# Altium project Echiquier.PrjPcb
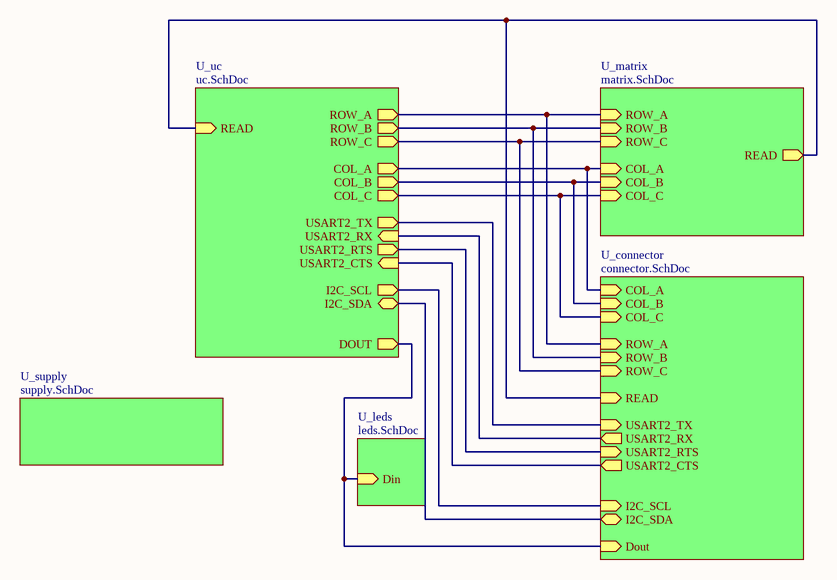
[diagram p0: chess_top.SchDoc]
5 sheets, 163 parts. Net scope: hierarchical (ports join the sheet entries above them; power ports are global).
Board file: ES_Class6C_2L.PcbDoc
Sheets:
  chess_top.SchDoc
    U_connector = connector.SchDoc
    U_matrix = matrix.SchDoc
    U_uc = uc.SchDoc
    U_supply = supply.SchDoc

## Sheet chess_top.SchDoc
size A4

### Sub-sheets
U_connector = connector.SchDoc: COL_C (in), COL_B (in), Dout (in), COL_A (in), ROW_B (in), USART2_RTS (in), USART2_RX (out), READ (in), USART2_TX (in), USART2_CTS (out), ROW_C (in), ROW_A (in), I2C_SDA (bidir), I2C_SCL (in)
U_leds = leds.SchDoc (file not in this document): Din (in)
U_matrix = matrix.SchDoc: COL_A (in), COL_B (in), ROW_B (in), COL_C (in), ROW_C (in), ROW_A (in), READ (out)
U_supply = supply.SchDoc: no entries
U_uc = uc.SchDoc: ROW_A (out), ROW_B (out), ROW_C (out), COL_A (out), COL_B (out), COL_C (out), READ (in), USART2_TX (out), USART2_RX (in), USART2_RTS (out), USART2_CTS (in), DOUT (out), I2C_SCL (out), I2C_SDA (bidir)

### Nets
COL0: sheet U_connector/COL_A, sheet U_matrix/COL_A, sheet U_uc/COL_A
COL1: sheet U_connector/COL_B, sheet U_matrix/COL_B, sheet U_uc/COL_B
COL2: sheet U_connector/COL_C, sheet U_matrix/COL_C, sheet U_uc/COL_C
DOUT: sheet U_connector/Dout, sheet U_leds/Din, sheet U_uc/DOUT
I2C1_SCL: sheet U_connector/I2C_SCL, sheet U_uc/I2C_SCL
I2C1_SDA: sheet U_connector/I2C_SDA, sheet U_uc/I2C_SDA
READ: sheet U_connector/READ, sheet U_matrix/READ, sheet U_uc/READ
ROW0: sheet U_connector/ROW_A, sheet U_matrix/ROW_A, sheet U_uc/ROW_A
ROW1: sheet U_connector/ROW_B, sheet U_matrix/ROW_B, sheet U_uc/ROW_B
ROW2: sheet U_connector/ROW_C, sheet U_matrix/ROW_C, sheet U_uc/ROW_C
U2CTS: sheet U_connector/USART2_CTS, sheet U_uc/USART2_CTS
U2RTS: sheet U_connector/USART2_RTS, sheet U_uc/USART2_RTS
U2RX: sheet U_connector/USART2_RX, sheet U_uc/USART2_RX
U2TX: sheet U_connector/USART2_TX, sheet U_uc/USART2_TX

## Sheet connector.SchDoc
size A4
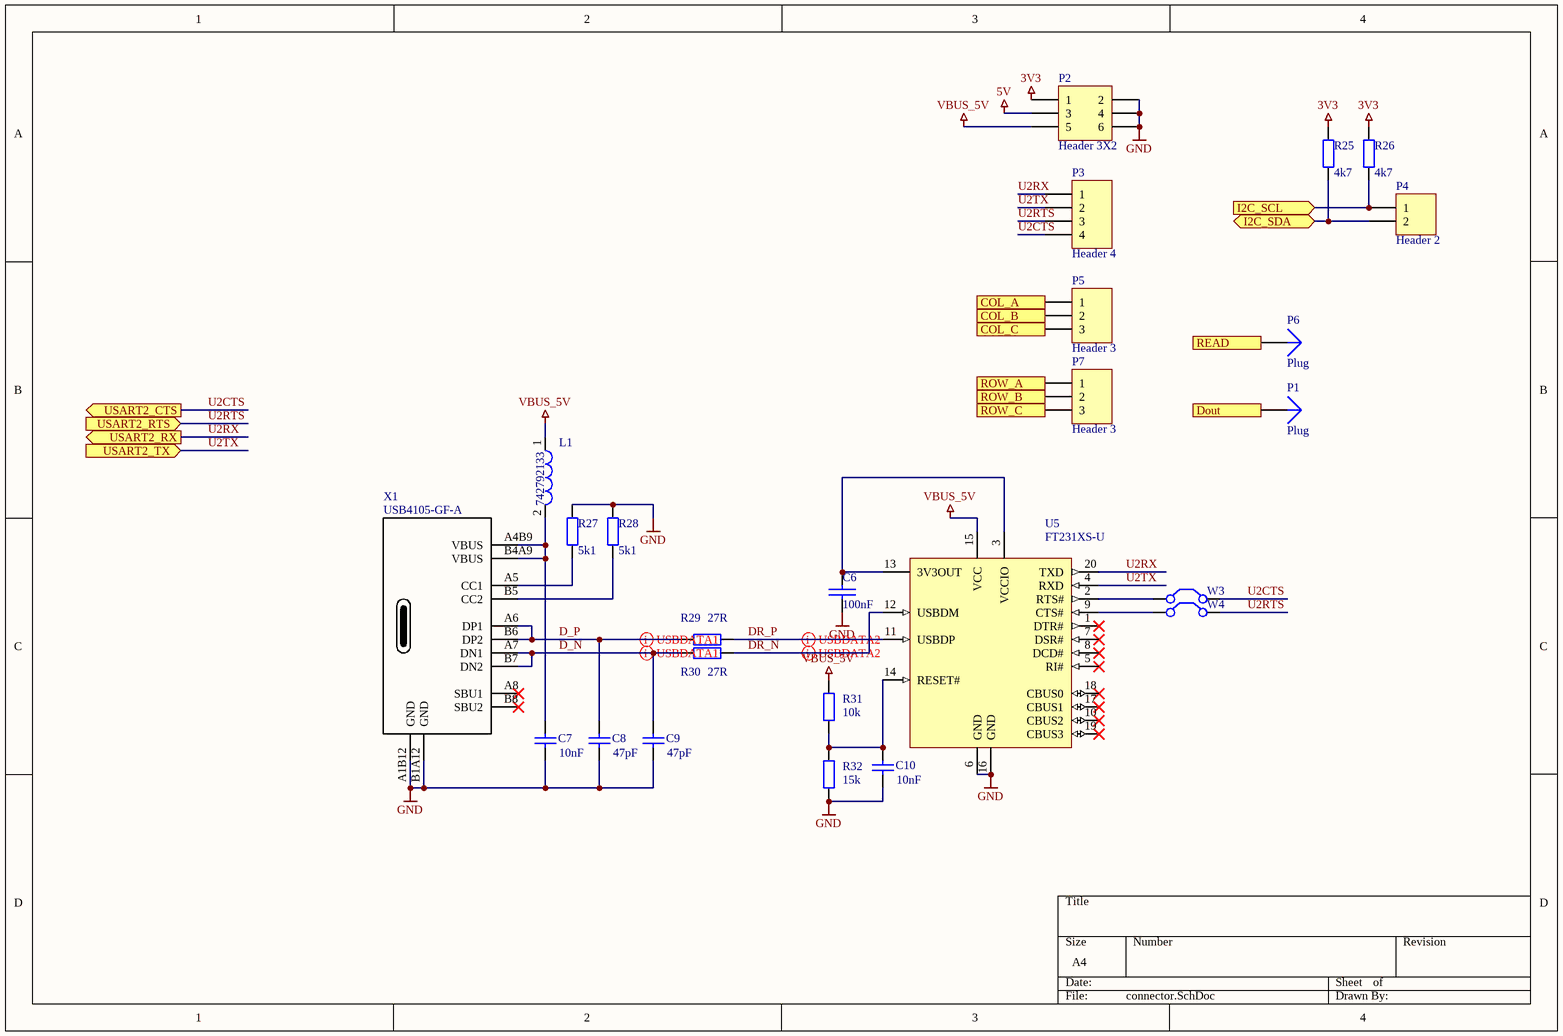
[diagram p1: connector.SchDoc]

### Parts
C6  100nF  [Cap_0805]
C7  10nF  [6-0805_L]
C8  47pF  [6-0805_L]
C9  47pF  [6-0805_L]
C10  10nF  [Cap_0805]
L1  742792133  [SMD-1206]
P1  Plug  [PIN1]
P2  Header 3X2  [HDR2X3]
P3  Header 4  [HDR1X4]
P4  Header 2  [HDR1X2]
P5  Header 3  [HDR1X3]
P6  Plug  [PIN1]
P7  Header 3  [HDR1X3]
R25  value 4k7  [RES_0805]  (hidden comment: 5k1)
R26  value 4k7  [RES_0805]  (hidden comment: 5k1)
R27  5k1  [RES_0805]
R28  5k1  [RES_0805]
R29  27R  [RES_0805]
R30  27R  [RES_0805]
R31  10k  [RES_0805]
R32  15k  [RES_0805]
U5  FT231XS-U  [SSOP-20_M]
W3  Jumper  [JUMPER]  (value not drawn)
W4  Jumper  [JUMPER]  (value not drawn)
X1  USB4105-GF-A  [GCT_USB4105-GF-A]

### Ports
COL_A (in), COL_B (in), COL_C (in), Dout (in), I2C_SCL (in), I2C_SDA (bidir), READ (in), ROW_A (in), ROW_B (in), ROW_C (in), USART2_CTS (out), USART2_RTS (in), USART2_RX (out), USART2_TX (in)

### Nets
3V3: P2.1 R25.2 R26.2
5V: P2.3
GND: C6.2 C7.1 C8.1 C9.1 C10.1 P2.2 P2.4 P2.6 R27.2 R28.2 R32.1 U5.6(GND) U5.16(GND) X1.A1B12(GND) X1.B1A12(GND)
VBUS_5V: L1.1 P2.5 R31.2 U5.15(VCC)
COL0: P5.1 ; port COL_A
COL1: P5.2 ; port COL_B
COL2: P5.3 ; port COL_C
D_N: C9.2 R30.1 X1.A7(DN1) X1.B7(DN2)
D_P: C8.2 R29.1 X1.A6(DP1) X1.B6(DP2)
DOUT: P1.1 ; port Dout
DR_N: R30.2 U5.12(USBDM)
DR_P: R29.2 U5.11(USBDP)
I2C1_SCL: P4.1 R26.1 ; port I2C_SCL
I2C1_SDA: P4.2 R25.1 ; port I2C_SDA
READ: P6.1 ; port READ
ROW0: P7.1 ; port ROW_A
ROW1: P7.2 ; port ROW_B
ROW2: P7.3 ; port ROW_C
U2CTS: P3.4 W3.2(C2) ; port USART2_CTS
U2RTS: P3.3 W4.2(C2) ; port USART2_RTS
U2RX: P3.1 U5.20(TXD) ; port USART2_RX
U2TX: P3.2 U5.4(RXD) ; port USART2_TX
NetC6_1: C6.1 U5.3(VCCIO) U5.13(3V3OUT)
NetC7_2: C7.2 L1.2 X1.A4B9(VBUS) X1.B4A9(VBUS)
NetC10_2: C10.2 R31.1 R32.2 U5.14(RESET#)
NetR27_1: R27.1 X1.A5(CC1)
NetR28_1: R28.1 X1.B5(CC2)
NetU5_2: U5.2(RTS#) W3.1(C1)
NetU5_9: U5.9(CTS#) W4.1(C1)

Not connected (* = marked no-connect by the designer): U5 1(DTR#)* 5(RI#)* 7(DSR#)* 8(DCD#)* 10(CBUS2)* 17(CBUS1)* 18(CBUS0)* 19(CBUS3)*; X1 A8(SBU1)* B8(SBU2)*

### Layout directives
differential pair: D_N, D_P, DR_N, DR_P

### Library data of the parts
C6 = C: SDTSourceLibName: C:\WINDOWS\TEMP\DA.LIB; PCB Footprint: RC0805
C7-C10 = Cap: Capacitor; Published: 8-Jun-2000; LatestRevisionDate: 17-Jul-2002; LatestRevisionNote: Re-released for DXP Platform.; PackageReference: RAD-0.3; Publisher: Altium Limited; PackageDescription: Radial Cap, Thru-Hole; 2 Leads; 0.3 in Pin Spacing
  C7 C10: Value: 10nF
  C8 C9: Value: 47pF
L1 = CMP-0220-00010-1: SMD EMI Suppression Ferrite Bead WE-CBF, Z = 600 Ohm; Impedance: 600 Ohm; ComponentLink1Description: Manufacturer Link; DatasheetVersion: ver 2, Aug-2007; ComponentLink1URL: http://www.we-online.com; PackageDescription: Chip Inductor, 2-Leads, Body 3.2 x 1.6 mm; ComponentLink2URL: http://www.we-online.de/katalog/media/pdf/742792133.pdf; PackageVersion: 2007; PackageReference: SMD-1206; ComponentLink2Description: Datasheet
P2 = Header 3X2: Header, 3-Pin, Dual row; LatestRevisionDate: 17-Jul-2002; LatestRevisionNote: Re-released for DXP Platform.; Publisher: Altium Limited
P3 = Header 4: Header, 4-Pin; LatestRevisionDate: 17-Jul-2002; LatestRevisionNote: Re-released for DXP Platform.; Publisher: Altium Limited
P4 = Header 2: Header, 2-Pin; LatestRevisionDate: 17-Jul-2002; LatestRevisionNote: Re-released for DXP Platform.; Publisher: Altium Limited
P5 P7 = Header 3: Header, 3-Pin; LatestRevisionDate: 17-Jul-2002; LatestRevisionNote: Re-released for DXP Platform.; Publisher: Altium Limited
R25-R32 = Res2: Res 0805; Published: 8-Jun-2000; LatestRevisionDate: 17-Jul-2002; LatestRevisionNote: Re-released for DXP Platform.; PackageReference: AXIAL-0.4; Publisher: Altium Limited; PackageDescription: Axial Device, Thru-Hole; 2 Leads; 0.4 in Pin Spacing
  R27 R28: Value: 5k1
  R29 R30: Value: 27R
  R31: Value: 10k
  R32: Value: 15k
U5 = CMP-0248-00015-2: USB to Full-Handshake UART Interface Chip, UHCI/OHCI/EHCI Compatible, USB 2.0 Compatible, -40 to +85 degC, 20-Pin SSOP, Pb-Free, Tube; Manufacturer: FTDI; PackageDescription: 20-Pin Small Outline Package, 8.6 x 3.9 mm Body, 0.635 mm Pitch; ComponentLink2Description: Datasheet; DatasheetVersion: ver 1.2, Feb-2013; PackageReference: SSOP-20; ComponentLink3URL: www.ftdichip.com/Products/ICs/FT231X.html; ComponentLink2URL: http://www.ftdichip.com/Support/Documents/DataSheets/ICs/DS_FT231X.pdf; PartNumber: FT231XS-U; ComponentLink3Description: FT231X Product Page; ComponentLink1URL: http://www.ftdichip.com/; Code_JEDEC: MO-137-AD; ComponentLink1Description: Manufacturer URL; RevisionNote: DatasheetVersion updated to 1.2 Feb-2013; PackageVersion: Feb-13
W3 W4 = Jumper: Jumper Wire; Published: 24-Mar-1999; LatestRevisionDate: 17-Jul-2002; LatestRevisionNote: Re-released for DXP Platform.; PackageReference: RAD-0.2; Publisher: Altium Limited; PackageDescription: Radial Cap, Thru-Hole; 2 Leads; 0.2 in Pin Spacing
X1 = USB-C Type 2.0: USB4105-GF-A USB connector; ComponentLink1Description: LCSC  C319148; ComponentLink1URL: https://lcsc.com/product-detail/USB-Connectors_XKB-Connectivity-U262-161N-4BVC11_C319148.html; Supplier 1: LCSC; Supplier Part Number 1: C319148
P1 P6 = Plug: LatestRevisionDate: 17-Jul-2002; LatestRevisionNote: Re-released for DXP Platform.; Publisher: Altium Limited

## Sheet matrix.SchDoc
size A3
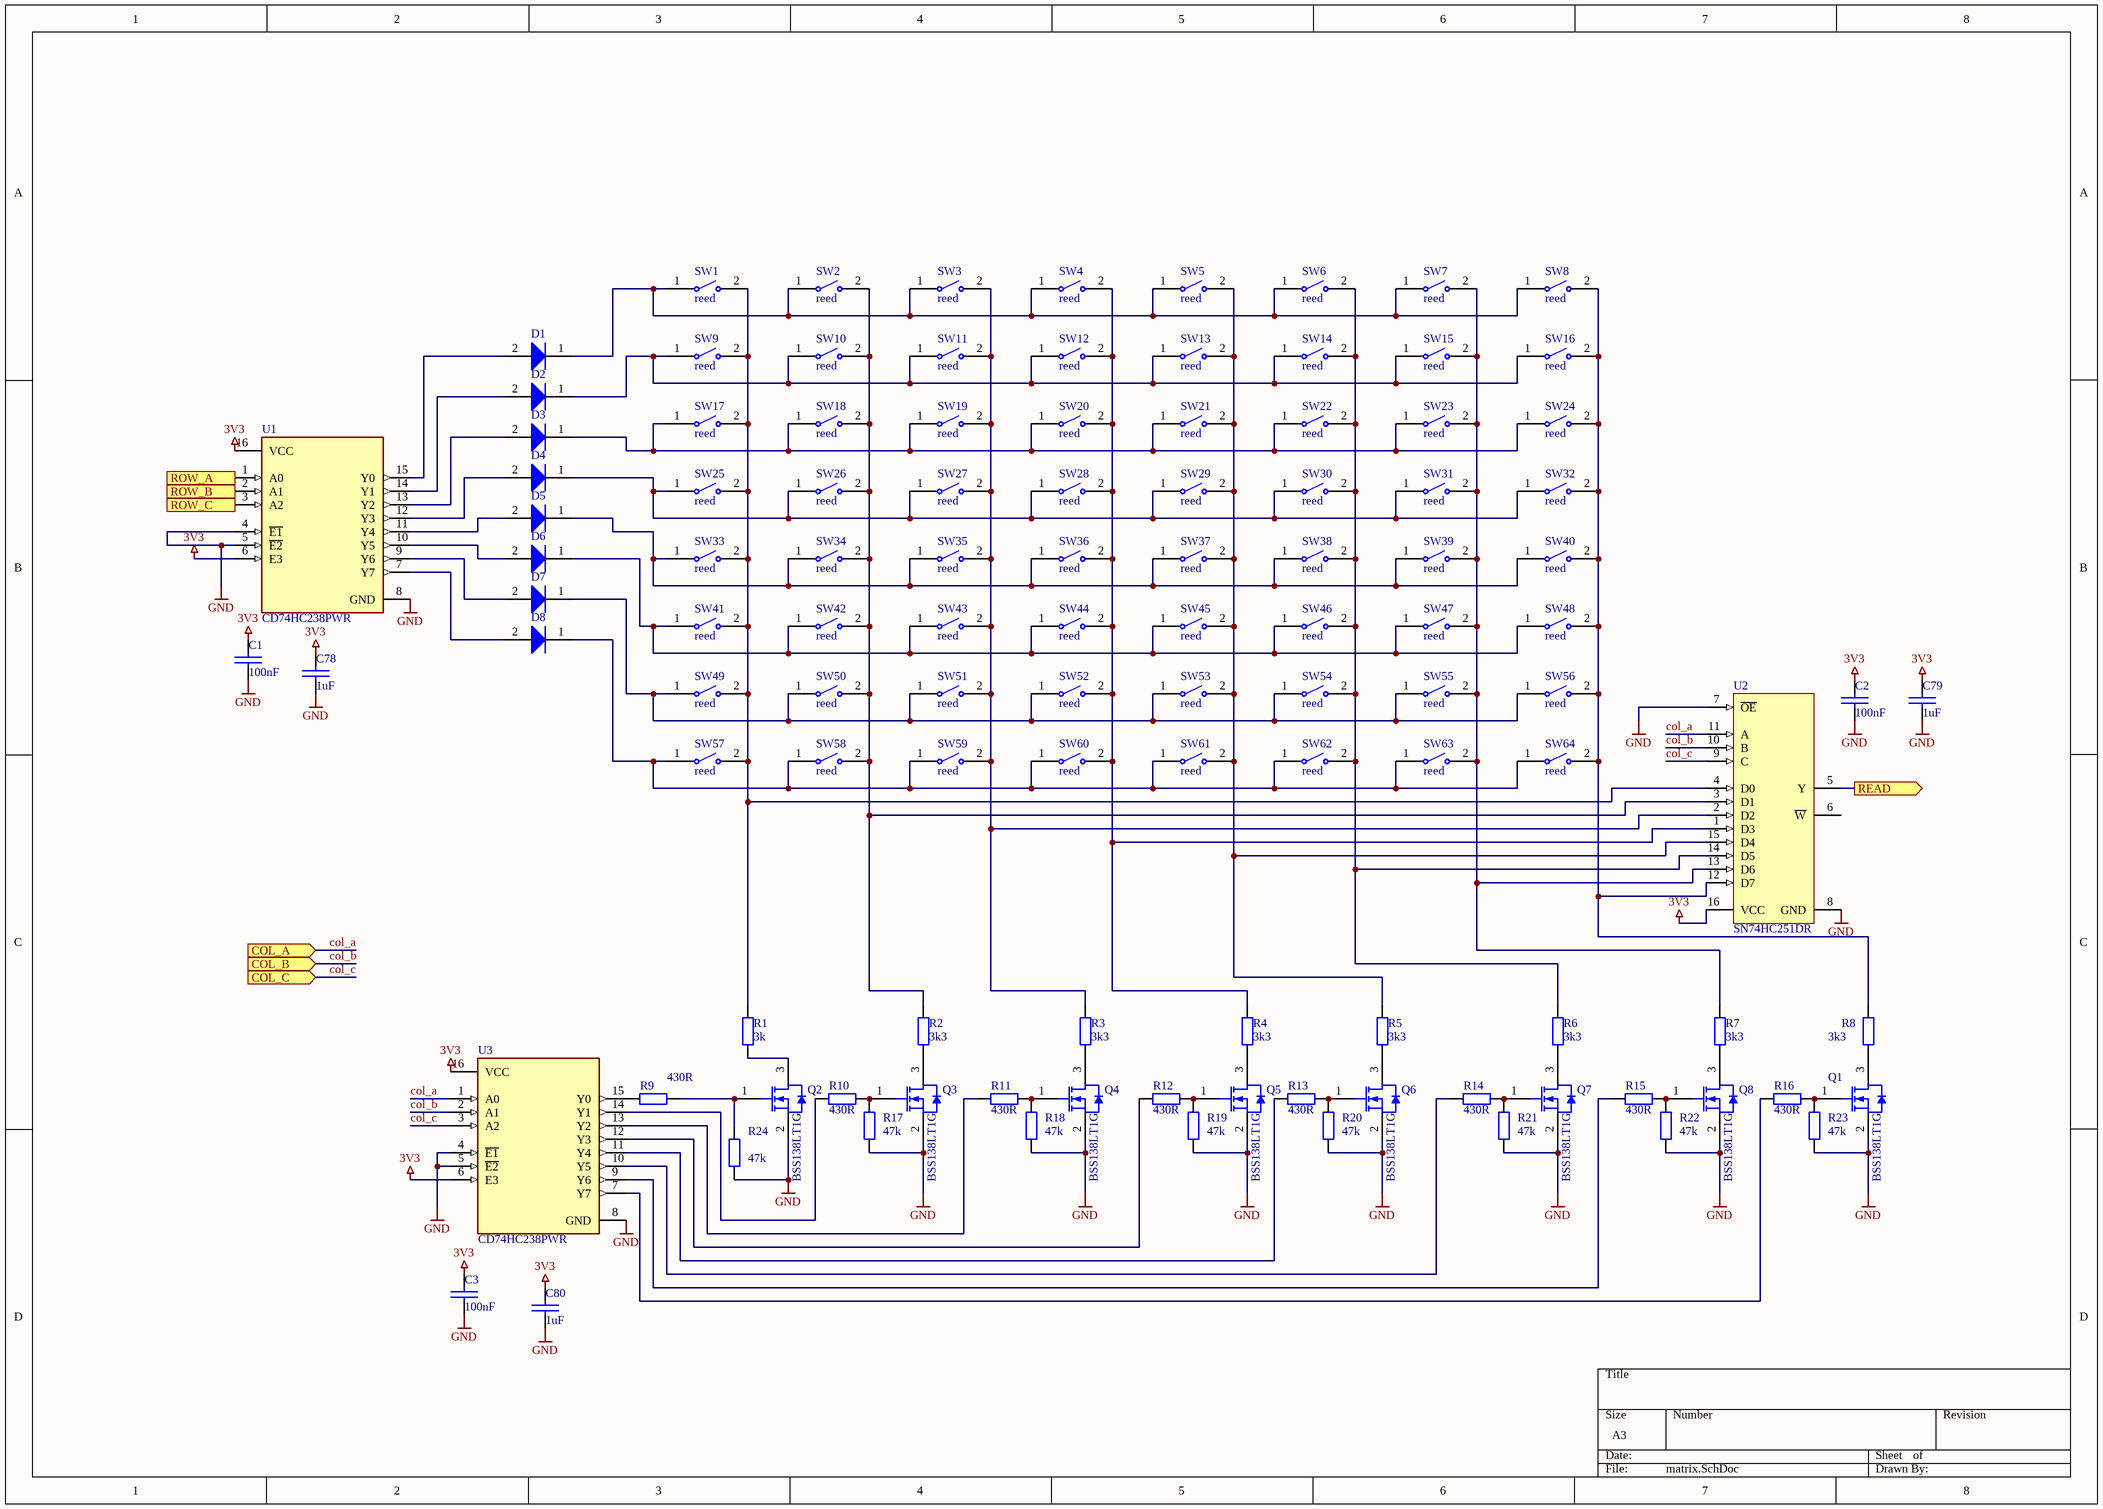
[diagram p2: matrix.SchDoc]

### Parts
C1  100nF  [Cap_0805]
C2  100nF  [Cap_0805]
C3  100nF  [Cap_0805]
C78  1uF  [Cap_0805]
C79  1uF  [Cap_0805]
C80  1uF  [Cap_0805]
D1  BAT54HT1G  [ONSC-SOD-323-2-477-02_V]  (value not drawn)
D2  BAT54HT1G  [ONSC-SOD-323-2-477-02_V]  (value not drawn)
D3  BAT54HT1G  [ONSC-SOD-323-2-477-02_V]  (value not drawn)
D4  BAT54HT1G  [ONSC-SOD-323-2-477-02_V]  (value not drawn)
D5  BAT54HT1G  [ONSC-SOD-323-2-477-02_V]  (value not drawn)
D6  BAT54HT1G  [ONSC-SOD-323-2-477-02_V]  (value not drawn)
D7  BAT54HT1G  [ONSC-SOD-323-2-477-02_V]  (value not drawn)
D8  BAT54HT1G  [ONSC-SOD-323-2-477-02_V]  (value not drawn)
Q1  BSS138LT1G  [ONSC-SOT-23-3-318-08_V]
Q2  BSS138LT1G  [ONSC-SOT-23-3-318-08_V]
Q3  BSS138LT1G  [ONSC-SOT-23-3-318-08_V]
Q4  BSS138LT1G  [ONSC-SOT-23-3-318-08_V]
Q5  BSS138LT1G  [ONSC-SOT-23-3-318-08_V]
Q6  BSS138LT1G  [ONSC-SOT-23-3-318-08_V]
Q7  BSS138LT1G  [ONSC-SOT-23-3-318-08_V]
Q8  BSS138LT1G  [ONSC-SOT-23-3-318-08_V]
R1  value 3k  [RES_0805]  (hidden comment: 430R)
R2  value 3k3  [RES_0805]  (hidden comment: 430R)
R3  value 3k3  [RES_0805]  (hidden comment: 430R)
R4  value 3k3  [RES_0805]  (hidden comment: 430R)
R5  value 3k3  [RES_0805]  (hidden comment: 430R)
R6  value 3k3  [RES_0805]  (hidden comment: 430R)
R7  value 3k3  [RES_0805]  (hidden comment: 430R)
R8  value 3k3  [RES_0805]  (hidden comment: 430R)
R9  430R  [RES_0805]
R10  430R  [RES_0805]
R11  430R  [RES_0805]
R12  430R  [RES_0805]
R13  430R  [RES_0805]
R14  430R  [RES_0805]
R15  430R  [RES_0805]
R16  430R  [RES_0805]
R17  value 47k  [RES_0805]  (hidden comment: 10k)
R18  value 47k  [RES_0805]  (hidden comment: 10k)
R19  value 47k  [RES_0805]  (hidden comment: 10k)
R20  value 47k  [RES_0805]  (hidden comment: 10k)
R21  value 47k  [RES_0805]  (hidden comment: 10k)
R22  value 47k  [RES_0805]  (hidden comment: 10k)
R23  value 47k  [RES_0805]  (hidden comment: 10k)
R24  value 47k  [RES_0805]  (hidden comment: 10k)
SW1  reed  [reed]
SW2  reed  [reed]
SW3  reed  [reed]
SW4  reed  [reed]
SW5  reed  [reed]
SW6  reed  [reed]
SW7  reed  [reed]
SW8  reed  [reed]
SW9  reed  [reed]
SW10  reed  [reed]
SW11  reed  [reed]
SW12  reed  [reed]
SW13  reed  [reed]
SW14  reed  [reed]
SW15  reed  [reed]
SW16  reed  [reed]
SW17  reed  [reed]
SW18  reed  [reed]
SW19  reed  [reed]
SW20  reed  [reed]
SW21  reed  [reed]
SW22  reed  [reed]
SW23  reed  [reed]
SW24  reed  [reed]
SW25  reed  [reed]
SW26  reed  [reed]
SW27  reed  [reed]
SW28  reed  [reed]
SW29  reed  [reed]
SW30  reed  [reed]
SW31  reed  [reed]
SW32  reed  [reed]
SW33  reed  [reed]
SW34  reed  [reed]
SW35  reed  [reed]
SW36  reed  [reed]
SW37  reed  [reed]
SW38  reed  [reed]
SW39  reed  [reed]
SW40  reed  [reed]
SW41  reed  [reed]
SW42  reed  [reed]
SW43  reed  [reed]
SW44  reed  [reed]
SW45  reed  [reed]
SW46  reed  [reed]
SW47  reed  [reed]
SW48  reed  [reed]
SW49  reed  [reed]
SW50  reed  [reed]
SW51  reed  [reed]
SW52  reed  [reed]
SW53  reed  [reed]
SW54  reed  [reed]
SW55  reed  [reed]
SW56  reed  [reed]
SW57  reed  [reed]
SW58  reed  [reed]
SW59  reed  [reed]
SW60  reed  [reed]
SW61  reed  [reed]
SW62  reed  [reed]
SW63  reed  [reed]
SW64  reed  [reed]
U1  CD74HC238PWR  [FP-PW0016A-IPC_A]
U2  SN74HC251DR  [D0016A_L]
U3  CD74HC238PWR  [FP-PW0016A-IPC_A]

### Ports
COL_A (in), COL_B (in), COL_C (in), READ (out), ROW_A (in), ROW_B (in), ROW_C (in)

### Nets
3V3: C1.1 C2.1 C3.1 C78.1 C79.1 C80.1 U1.6(E3) U1.16(VCC) U2.16(VCC) U3.6(E3) U3.16(VCC)
GND: C1.2 C2.2 C3.2 C78.2 C79.2 C80.2 Q1.2(S) Q2.2(S) Q3.2(S) Q4.2(S) Q5.2(S) Q6.2(S) Q7.2(S) Q8.2(S) R17.1 R18.1 R19.1 R20.1 R21.1 R22.1 R23.1 R24.1 U1.4(~{E1}) U1.5(~{E2}) U1.8(GND) U2.7(~{OE}) U2.8(GND) U3.4(~{E1}) U3.5(~{E2}) U3.8(GND)
col_a: U2.11(A) U3.1(A0) ; port COL_A  [project net COL0]
col_b: U2.10(B) U3.2(A1) ; port COL_B  [project net COL1]
col_c: U2.9(C) U3.3(A2) ; port COL_C  [project net COL2]
READ: U2.5(Y) ; port READ
ROW0: U1.1(A0) ; port ROW_A
ROW1: U1.2(A1) ; port ROW_B
ROW2: U1.3(A2) ; port ROW_C
NetD1_1: D1.1(K) SW1.1 SW2.1 SW3.1 SW4.1 SW5.1 SW6.1 SW7.1 SW8.1
NetD1_2: D1.2(A) U1.15(Y0)
NetD2_1: D2.1(K) SW9.1 SW10.1 SW11.1 SW12.1 SW13.1 SW14.1 SW15.1 SW16.1
NetD2_2: D2.2(A) U1.14(Y1)
NetD3_1: D3.1(K) SW17.1 SW18.1 SW19.1 SW20.1 SW21.1 SW22.1 SW23.1 SW24.1
NetD3_2: D3.2(A) U1.13(Y2)
NetD4_1: D4.1(K) SW25.1 SW26.1 SW27.1 SW28.1 SW29.1 SW30.1 SW31.1 SW32.1
NetD4_2: D4.2(A) U1.12(Y3)
NetD5_1: D5.1(K) SW33.1 SW34.1 SW35.1 SW36.1 SW37.1 SW38.1 SW39.1 SW40.1
NetD5_2: D5.2(A) U1.11(Y4)
NetD6_1: D6.1(K) SW41.1 SW42.1 SW43.1 SW44.1 SW45.1 SW46.1 SW47.1 SW48.1
NetD6_2: D6.2(A) U1.10(Y5)
NetD7_1: D7.1(K) SW49.1 SW50.1 SW51.1 SW52.1 SW53.1 SW54.1 SW55.1 SW56.1
NetD7_2: D7.2(A) U1.9(Y6)
NetD8_1: D8.1(K) SW57.1 SW58.1 SW59.1 SW60.1 SW61.1 SW62.1 SW63.1 SW64.1
NetD8_2: D8.2(A) U1.7(Y7)
NetQ1_1: Q1.1(G) R16.1 R23.2
NetQ1_3: Q1.3(D) R8.2
NetQ2_1: Q2.1(G) R9.1 R24.2
NetQ2_3: Q2.3(D) R1.2
NetQ3_1: Q3.1(G) R10.1 R17.2
NetQ3_3: Q3.3(D) R2.2
NetQ4_1: Q4.1(G) R11.1 R18.2
NetQ4_3: Q4.3(D) R3.2
NetQ5_1: Q5.1(G) R12.1 R19.2
NetQ5_3: Q5.3(D) R4.2
NetQ6_1: Q6.1(G) R13.1 R20.2
NetQ6_3: Q6.3(D) R5.2
NetQ7_1: Q7.1(G) R14.1 R21.2
NetQ7_3: Q7.3(D) R6.2
NetQ8_1: Q8.1(G) R15.1 R22.2
NetQ8_3: Q8.3(D) R7.2
NetR1_1: R1.1 SW1.2 SW9.2 SW17.2 SW25.2 SW33.2 SW41.2 SW49.2 SW57.2 U2.4(D0)
NetR2_1: R2.1 SW2.2 SW10.2 SW18.2 SW26.2 SW34.2 SW42.2 SW50.2 SW58.2 U2.3(D1)
NetR3_1: R3.1 SW3.2 SW11.2 SW19.2 SW27.2 SW35.2 SW43.2 SW51.2 SW59.2 U2.2(D2)
NetR4_1: R4.1 SW4.2 SW12.2 SW20.2 SW28.2 SW36.2 SW44.2 SW52.2 SW60.2 U2.1(D3)
NetR5_1: R5.1 SW5.2 SW13.2 SW21.2 SW29.2 SW37.2 SW45.2 SW53.2 SW61.2 U2.15(D4)
NetR6_1: R6.1 SW6.2 SW14.2 SW22.2 SW30.2 SW38.2 SW46.2 SW54.2 SW62.2 U2.14(D5)
NetR7_1: R7.1 SW7.2 SW15.2 SW23.2 SW31.2 SW39.2 SW47.2 SW55.2 SW63.2 U2.13(D6)
NetR8_1: R8.1 SW8.2 SW16.2 SW24.2 SW32.2 SW40.2 SW48.2 SW56.2 SW64.2 U2.12(D7)
NetR9_2: R9.2 U3.15(Y0)
NetR10_2: R10.2 U3.14(Y1)
NetR11_2: R11.2 U3.13(Y2)
NetR12_2: R12.2 U3.12(Y3)
NetR13_2: R13.2 U3.11(Y4)
NetR14_2: R14.2 U3.10(Y5)
NetR15_2: R15.2 U3.9(Y6)
NetR16_2: R16.2 U3.7(Y7)

Not connected (* = marked no-connect by the designer): U2 6(~{W})

### Library data of the parts
C1-C3 C78-C80 = C: as C6 on sheet connector
D1-D8 = CMP-1055-00462-1: Schottky Barrier Diode, 2-Pin SOD-323, Pb-Free, Tape and Reel; Manufacturer: On Semiconductor; Configuration: Single; trr Max (ns): 5; IFSM Max (A): 0.6; ComponentLink3URL: http://www.onsemi.com/pub_link/Collateral/477-02.PDF.1; PackageDescription: 2-Pin SOD, Body 1.7 x 1.25 mm; ComponentLink2URL: http://www.onsemi.cn/pub_link/Collateral/BAT54HT1-D.PDF; ComponentLink3Description: Package Specification; ComponentLink2Description: Datasheet; DatasheetVersion: Rev. 6; PackageReference: SOD-323-2-477-02; RoHS: TRUE; ComponentLink1URL: http://www.onsemi.com/; Packing: Tape and Reel; PartNumber: BAT54HT1G; Mounting Technology: Surface Mount; ComponentLink1Description: Manufacturer URL; PackageVersion: Rev. H, 03/2007
Q1-Q8 = CMP-1058-00767-1: Power MOSFET, 200 mA, 50 V, N-Channel, 3-Pin SOT-23, Pb-Free, Tape and Reel; Manufacturer: On Semiconductor; PD Max (W): 0.225; Coss Typ (pF): 12; V(BR)DSS Min (V): 50; VGS Max (V): 20; Channel Polarity: N Channel; Configuration: Single; VGS(th) Max (V): 1.5; Ciss Typ (pF): 40; Crss Typ (pF): 3.5; ID Max (A): 0.2; ComponentLink3Description: Package Specification; PackageDescription: 3-Pin Small Outline Transistor, Body 2.92 x 1.3 mm, Pitch 0.95 mm; PackageReference: SOT-23-3-318-08; RoHS: Pb-Free; Mounting Technology: Surface Mount; ComponentLink1Description: Manufacturer URL; ComponentLink2URL: http://www.onsemi.com/pub_link/Collateral/BSS138LT1-D.PDF; ComponentLink2Description: Datasheet; Packing: Tape and Reel; PackageVersion: Rev. AP, 11/2009; PartNumber: BSS138LT1G; Package Type: SOT-23-3; ComponentLink1URL: http://www.onsemi.com/; DatasheetVersion: Rev. 8; ComponentLink3URL: http://www.onsemi.cn/pub_link/Collateral/318-08.PDF
R1-R24 = Res2: Res 0805; Published: 8-Jun-2000; LatestRevisionDate: 17-Jul-2002; LatestRevisionNote: Re-released for DXP Platform.; PackageReference: AXIAL-0.4; Publisher: Altium Limited; PackageDescription: Axial Device, Thru-Hole; 2 Leads; 0.4 in Pin Spacing
  R9-R16: Value: 430R
U1 U3 = CMP-1633-00899-3: IC DECODER/DEMUX 1X3:8 16TSSOP; Max Supply Voltage: 6V; Low Level Output Current: 5.2mA; Number of Channels: 1; Quiescent Current: 8uA; Min Supply Voltage: 2V; Supply Type: Single; Polarity: Non-Inverting; Number of Input Lines: 3; Output Current: 25mA; Turn-On Delay Time: 265ns; Number of Output Lines: 8; Logic Function: Demultiplexer; High Level Output Current: -5.2mA; Rise Time: 400ns; Bandwidth: 28MHz; Max Operating Temperature: 125°C; Independent Circuits: 1; Weight: 0.002183oz; Radiation Hardening: No; Output Voltage: 6V; Min Operating Temperature: -55°C; Package Quantity: 2000; REACH SVHC: No SVHC; Packaging: Tape and Reel; Lead Free: Lead Free; Contact Plating: Gold; Mount: Surface Mount; Height: 1.15mm; Case/Package: TSSOP; Number of Bits: 8; Number of Inputs: 3; Termination: SMD/SMT; Number of Outputs: 8; Number of Pins: 16; Number of Circuits: 1; Max Supply Current: 8uA; Series: 74HC; Number of Elements: 1; RoHS Compliant: Yes; Length: 5mm; Propagation Delay: 265ns; Width: 4.4mm; Technology: CMOS; Max Frequency: 28MHz
U2 = CMP-1633-00067-2: Data Selectors/Multiplexers With 3-State Outputs, D0016A, LARGE T&R; Manufacturer: Texas Instruments; Input Type: LVTTL/CMOS; Rating: Catalog; F @ Nom Voltage(Max)(Mhz): 28; Voltage(Nom)(V): 3.3,5; tpd @ Nom Voltage(Max)(ns): 51; Schmitt Trigger: No; VCC(Max)(V): 6; VCC(Min)(V): 2; Channels(#): 1; Configuration: 8：1; Bits(#): 8; Function: Encoder/Multiplexer; ICC @ Nom Voltage(Max)(mA): 0.08; Output Type: CMOS; Technology Family: HC; Output Drive (IOL/IOH)(Max)(mA): 7.8/-7.8; PackageReference: D0016A; Type: 3-State Output; Operating Temperature Range(C): -40 to 85; Code_JEDEC: MS-012 variation AC; DatasheetVersion: SCLS132E; Generic Part Number: SN74HC251

## Sheet uc.SchDoc
size A4
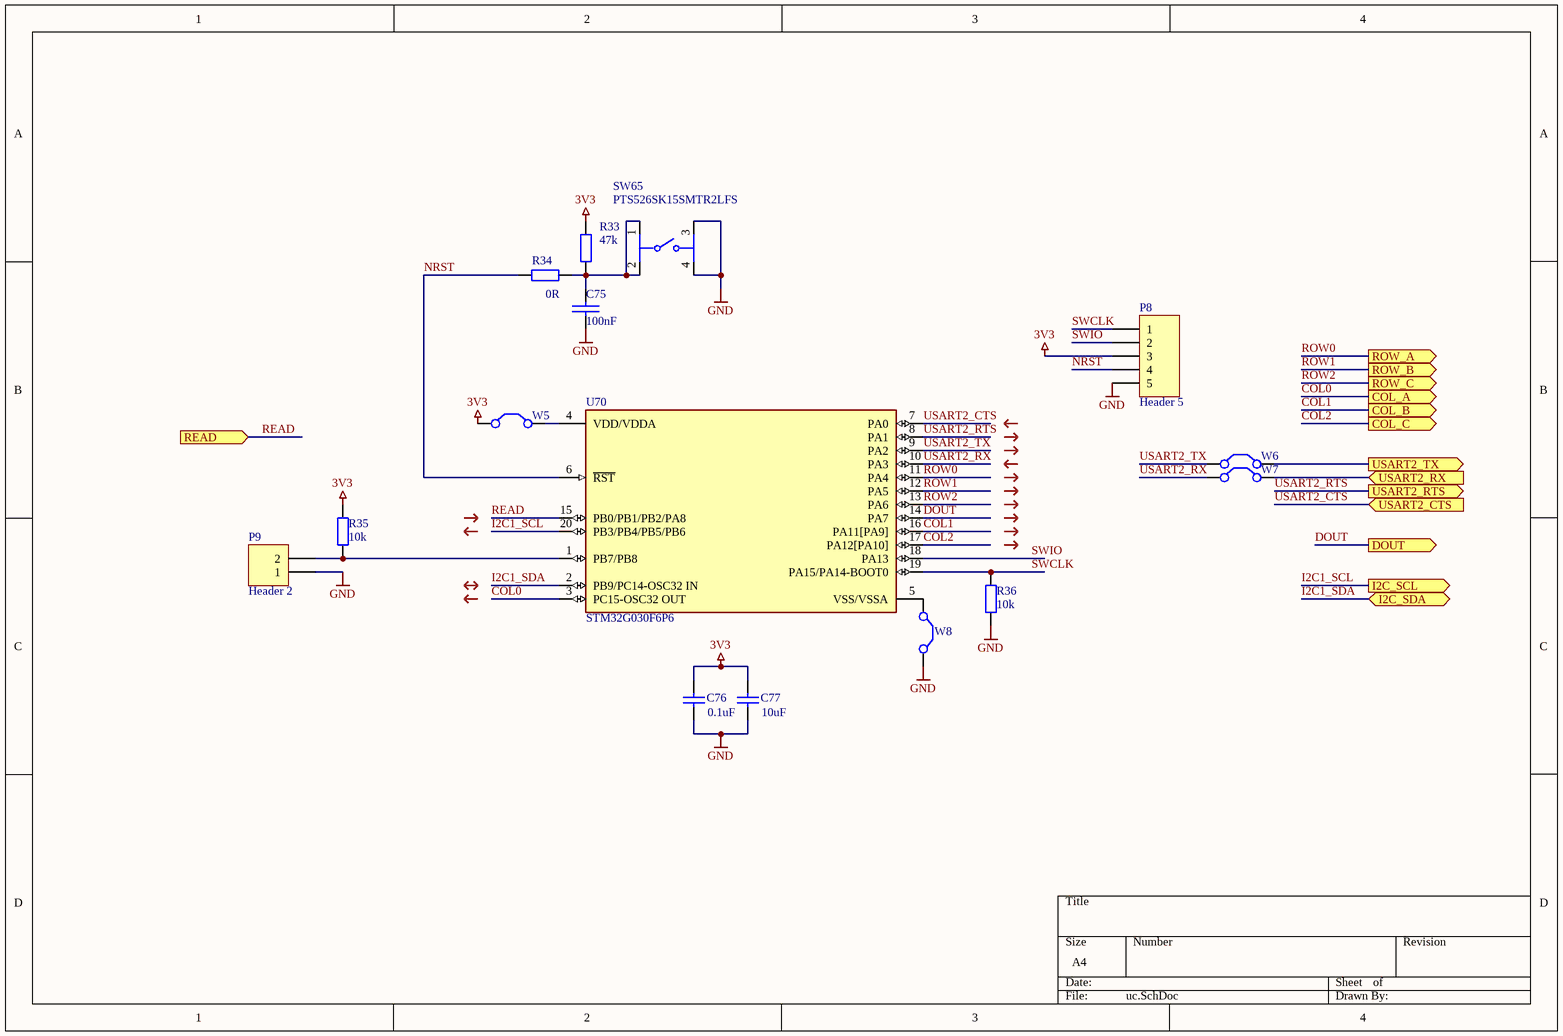
[diagram p3: uc.SchDoc]

### Parts
C75  100nF  [Cap_0805]
C76  0.1uF  [Cap_0805]
C77  10uF  [Cap_0805]
P8  Header 5  [HDR1X5]
P9  Header 2  [HDR1X2]
R33  47k  [RES_0805]
R34  0R  [RES_0805]
R35  10k  [RES_0805]
R36  10k  [RES_0805]
SW65  PTS526SK15SMTR2LFS  [FP-PTS526SK15SMTR2LFS-MFG]
U70  STM32G030F6P6  [FP-TSSOP20-YA-MFG]
W5  Jumper  [JUMPER]  (value not drawn)
W6  Jumper  [JUMPER]  (value not drawn)
W7  Jumper  [JUMPER]  (value not drawn)
W8  Jumper  [JUMPER]  (value not drawn)

### Ports
COL_A (out), COL_B (out), COL_C (out), DOUT (out), I2C_SCL (out), I2C_SDA (bidir), READ (in), ROW_A (out), ROW_B (out), ROW_C (out), USART2_CTS (in), USART2_RTS (out), USART2_RX (in), USART2_TX (out)

### Nets
3V3: C76.2 C77.2 P8.3 R33.1 R35.2 W5.1(C1)
GND: C75.2 C76.1 C77.1 P8.5 P9.1 R36.1 SW65.3 SW65.4 W8.2(C2)
COL0: U70.3(PC15-OSC32_OUT) ; port COL_A
COL1: U70.16(PA11[PA9]) ; port COL_B
COL2: U70.17(PA12[PA10]) ; port COL_C
DOUT: U70.14(PA7) ; port DOUT
I2C1_SCL: U70.20(PB3/PB4/PB5/PB6) ; port I2C_SCL
I2C1_SDA: U70.2(PB9/PC14-OSC32_IN) ; port I2C_SDA
NRST: P8.4 R34.1 U70.6(~{RST})
READ: U70.15(PB0/PB1/PB2/PA8) ; port READ
ROW0: U70.11(PA4) ; port ROW_A
ROW1: U70.12(PA5) ; port ROW_B
ROW2: U70.13(PA6) ; port ROW_C
SWCLK: P8.1 R36.2 U70.19(PA15/PA14-BOOT0)
SWIO: P8.2 U70.18(PA13)
U2RX: W7.2(C2) ; port USART2_RX
U2TX: W6.2(C2) ; port USART2_TX
USART2_CTS: U70.7(PA0) ; port USART2_CTS  [project net U2CTS]
USART2_RTS: U70.8(PA1) ; port USART2_RTS  [project net U2RTS]
USART2_RX: U70.10(PA3) W7.1(C1)
USART2_TX: U70.9(PA2) W6.1(C1)
NetC75_1: C75.1 R33.2 R34.2 SW65.1 SW65.2
NetP9_2: P9.2 R35.1 U70.1(PB7/PB8)
NetU70_4: U70.4(VDD/VDDA) W5.2(C2)
NetU70_5: U70.5(VSS/VSSA) W8.1(C1)

### Library data of the parts
C75 = C: as C6 on sheet connector
C76 C77 = Cap: Capacitor; Published: 8-Jun-2000; LatestRevisionDate: 17-Jul-2002; LatestRevisionNote: Re-released for DXP Platform.; PackageReference: RAD-0.3; Publisher: Altium Limited; PackageDescription: Radial Cap, Thru-Hole; 2 Leads; 0.3 in Pin Spacing
  C76: Value: 0.1uF
  C77: Value: 10uF
P8 = Header 5: Header, 5-Pin; LatestRevisionDate: 17-Jul-2002; LatestRevisionNote: Re-released for DXP Platform.; Publisher: Altium Limited
P9 = Header 2: Header, 2-Pin; LatestRevisionDate: 17-Jul-2002; LatestRevisionNote: Re-released for DXP Platform.; Publisher: Altium Limited
R33 R34 = Res2: Res 0805; Value: 1K; Published: 8-Jun-2000; LatestRevisionDate: 17-Jul-2002; LatestRevisionNote: Re-released for DXP Platform.; PackageReference: AXIAL-0.4; Publisher: Altium Limited; PackageDescription: Axial Device, Thru-Hole; 2 Leads; 0.4 in Pin Spacing
R35 R36 = Res2: Resistor; Published: 8-Jun-2000; LatestRevisionDate: 17-Jul-2002; LatestRevisionNote: Re-released for DXP Platform.; PackageReference: AXIAL-0.4; Publisher: Altium Limited; PackageDescription: Axial Device, Thru-Hole; 2 Leads; 0.4 in Pin Spacing; Value: 10k
SW65 = CMP-10040-000013-1: TACT 5.2 X 5.2, 1.5 MM H, 260GF,; Manufacturer: C&K; Operating Force: 250gf; Throw Configuration: SPST-NO; Contact Current Rating: 50mA; Standoff Height: 0mm; Contact Resistance: 100mΩ; Voltage Rating Dc: 12V; Electromechanical Life: 200000Cycles; Device Class L3: Tactile Switches; Device Class L2: Switches; Temperature: -20°C to +70°C; Temperature Range Low: -20°C; Package: PTS526SK15SMTR2LFS; Temperature Range High: +70°C; ComponentLink2Description: Datasheet; Device Class L1: Electromechanical; Height: 1.65mm; Digikey Description: TACT 5.2 X 5.2, 1.5 MM H, 260GF,; Category: Switch; RoHS: TRUE; Automotive: No; Lead Free: Yes; Manufacturer Part Number: PTS526SK15SMTR2LFS; Octopart: https://octopart.com/pts526+sk15+smtr2+lfs-c%26k+components-100617999; ComponentLink2URL: https://www.ckswitches.com/media/2780/pts526.pdf
U70 = CMP-12105-000034-1: ARM MICROCONTROLLERS - MCU; Manufacturer: STMicroelectronics; Max Supply Voltage: 3.6V; Interface: I2C,SPI,USART,LIN,IrDA,I2S,SMBus; Memory Size: 32KBytes; Number Of I/Os: 17; Number Of Timers/Counters: 6; Core Architecture: ARM Cortex-M0+; Number Of Pwm Channels: 11; Standoff Height: 0.05mm; Number Of A/D Converters: 1; Number Of I2C Channels: 2; Data Bus Width: 32bits; Ram Size: 8KBytes; Max Junction Temp: +105°C; Number Of Spi Channels: 3; Min Supply Voltage: 2V; Number Of Adc Channels: 16; Memory Type: FLASH; Frequency: 64MHz; Ambient Temperature Range Low: -40°C; ComponentLink2URL: https://www.st.com/resource/en/datasheet/stm32g030f6.pdf; Temperature Range Low: -40°C; Automotive: No; Device Class L1: Integrated Circuits (ICs); Category: IC; Temperature Range High: +85°C; ComponentLink2Description: Datasheet; Device Class L2: Embedded Processors and Controllers; Manufacturer Part Number: STM32G030F6P6; Height: 1.2mm; Ambient Temperature Range High: +85°C; Octopart: https://octopart.com/stm32g030f6p6-stmicroelectronics-103773023; Package: TSSOP20-YA; Temperature: -40°C to +85°C; Lead Free: Yes; Device Class L3: Microcontrollers; Number Of Uart Channels: 2; RoHS: TRUE; Number Of Cores: 1; Digikey Description: ARM MICROCONTROLLERS - MCU
W5-W8 = Jumper: Jumper Wire; Published: 24-Mar-1999; LatestRevisionDate: 17-Jul-2002; LatestRevisionNote: Re-released for DXP Platform.; PackageReference: RAD-0.2; Publisher: Altium Limited; PackageDescription: Radial Cap, Thru-Hole; 2 Leads; 0.2 in Pin Spacing

## Sheet supply.SchDoc
size A4
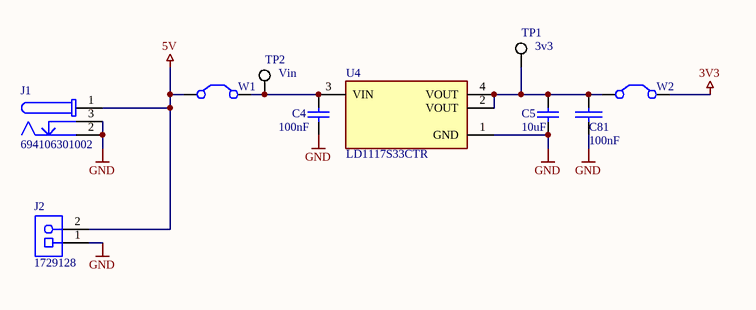
[diagram p4: supply.SchDoc]

### Parts
C4  100nF  [Cap_0805]
C5  10uF  [Cap_0805]
C81  100nF  [Cap_0805]
J1  694106301002  [694106301002]
J2  1729128  [PHOE-1729128-2_V]
TP1  3v3  [KSTN-5019_V]
TP2  Vin  [KSTN-5019_V]
U4  LD1117S33CTR  [FP-SOT-223-0046067_14-MFG]
W1  Jumper  [JUMPER]  (value not drawn)
W2  Jumper  [JUMPER]  (value not drawn)

### Nets
3V3: W2.2(C2)
5V: J1.1 J2.2 W1.1(C1)
GND: C4.1 C5.1 C81.2 J1.2 J1.3 J2.1 U4.1(GND)
NetC4_2: C4.2 TP2.1 U4.3(VIN) W1.2(C2)
NetC5_2: C5.2 C81.1 TP1.1 U4.2(VOUT) U4.4(VOUT) W2.1(C1)

### Library data of the parts
C4 C5 = Cap: Capacitor; Published: 8-Jun-2000; LatestRevisionDate: 17-Jul-2002; LatestRevisionNote: Re-released for DXP Platform.; PackageReference: RAD-0.3; Publisher: Altium Limited; PackageDescription: Radial Cap, Thru-Hole; 2 Leads; 0.3 in Pin Spacing
  C4: Value: 100nF
  C5: Value: 10uF
C81 = C: as C6 on sheet connector
J1 = CMP-1502-00188-2: NexarPartId: 52676100; Voltage Rating (DC): 20V; Gender: Male; Voltage Rating: 24V; Connector Type: Power; Insulation Resistance: 100MΩ; Current Rating: 5A; Shielding: Unshielded; Number of Contacts: 3; Color: Black; Housing Material: Polyamide; Contact Gender: Female; REACH SVHC: Unknown; Termination: Through Hole; Height: 11mm; RoHS: Compliant; Mount: Through Hole; Flammability Rating: UL94 V-0; Packaging: Bulk; Min Operating Temperature: -40°C; Contact Plating: Tin; Max Operating Temperature: 85°C; Operating Supply Voltage: 24V; Contact Material: Gold, Tin
J2 = CMP-2000-05815-1: PCB Terminal Block, 13.5 A, 400 V, 2-Pin THD, RoHS, Bulk; Manufacturer: Phoenix Contact; Package Version: 03/2015; No. of Rows: 1; Pitch: 5.08mm; No. of Positions: 2; Voltage Rating: 400V; Current Rating: 13500mA; Manufacturer URL: http://www.phoenixcontact.com/; Datasheet URL: https://datasheet.ciiva.com/16046/1729128-16046181.pdf; RoHS: TRUE; Package URL: https://www.phoenixcontact.com/online/portal/pi/pxc/product_detail_page/!ut/p/b1/3VdJjqNKFDxLH8AFycySyWY2ozFsEPOMMQaDOX1XedGL_1Vdm5YXJleknhSKeBkvI6EA8ncAo3AYoDhBQGco6KN7VURTdemj9us_IEKEZo_YHiPAEWEFmDGOHMORkqKYCORBZxgL7ZoaZYcbFFUZ3fqxSY6GOuxydWUuHqz1ynmMFygu583Bob0Ewr6Sd_l-5m-kAueHiB0jpRwZwe58wwtkpxtMYd_LmGcDRU02dRNEyWt6Y2ti5pSyJ_reIkzIulrqApdnbT11V5jnCKbYNCvhEM1MCpPByat_X379-iThf08CI5GfOPqfBeS3BRoBOdD55AKVv0iLwCMq-2BrzXWSGRH7pUGD9uwXQjiph3xL0DKQwdGa0JImiIOmBNOestqgwTHSSs2oOep-78apyXQBvNi8ZLaFjvjWvcaUEBu0MC6Wbe-d6mB0FAebo2lUWinqYaZs5DAYzV0RP9yitUjnGJ0iI9xhZkT42OCQNUJJhkgWINNQLP2JFP6OpMg3JCVg70jqHT0lvKOnhHf0lPuOnnLf0VPuWx6_dxwUIvwk5WMkT0kLL1mh61l2yZVSzG3pYV_bqo-mj6uMKwKwdnnW8Jh5RTOJzMOA5c-eJDaZQw4mTMPH02PvS_ZAqNVjVTo2WyYLkwH_KU1mmmG5kjRhDqPXLwwVHvVOjCM60-fpXvTDfMGW1PVFVS1r4e4yVDk4ZdNbkUHvqPqQSeian4UD39fNKmachqdJ1NJbyk8rXT9mXTvPk3oE5meulKGgiruPJek-4I9hTT6G8ZLOyRSm2RRVbThERQad5OS28hdt4YW4vG0stgYYzsWsK4_7y6DZMjJSCqri1kyiZR5vD7pwIrNR7QwPHTcLTI5qT7eRlpHrdGiupYlqQDJ7zy_CND8fWWBoLRXxk1RVcXiBQwbTD4Xi7KL-FuO94t9xaqweXzH; PartNumber: 1729128; Package Description: 2-Pin Through Hole Device, Body 8.1 x 10.16 mm, Pitch 5.08 mm; Datasheet Version: 12/2013; Mounting Technology: ThroughHole; Orientation: Horizontal; Package Reference: 1729128-2; Packing: Bulk
TP1 TP2 = CMP-1672-00008-1: Test Point, 1 Position SMD, RoHS, Tape and Reel; ComponentLink1Description: Manufacturer URL; Package Quantity: 1000; DatasheetVersion: 03/2014; Packaging: Tape and Reel; ComponentLink2URL: http://www.keyelco.com/product-pdf.cfm?p=1357; ComponentLink1URL: http://www.keyelco.com/; Mount: Surface Mount; Contact Plating: Silver; PackageDescription: 1-Pin Surface Mount Device, Body 3.81 x 2.03 mm; Pins: 1; RoHSCompliant: True; Mounting Technology: Surface Mount; ComponentLink2Description: Datasheet; PackageReference: 5019
U4 = CMP-0244-00307-2: IC REG LINEAR 3.3V 800MA SOT223; Input Bias Current: 5mA; Output Voltage Accuracy: 1%; Dropout Voltage: 1.1V; Power Dissipation: 12W; Polarity: Positive; Min Input Voltage: 5.3V; Quiescent Current: 10mA; Max Output Current: 1.3A; Output Current: 950mA; Number of Regulators: 1; Max Supply Voltage: 15V; Output Type: Fixed; Output Voltage: 3.3V; Number of Terminals: 4; Min Supply Voltage: 3.3V; Termination: SMD/SMT; Mount: Surface Mount; Max Power Dissipation: 12W; Case/Package: SOT-223; Lead Free: Lead Free; Height: 1.8mm; REACH SVHC: No SVHC; Radiation Hardening: No; Width: 3.5mm; Length: 6.5mm; Packaging: Tape and Reel; Max Input Voltage: 15V; Accuracy: 1%; Weight: 0.01lb; Contact Plating: Tin; Max Operating Temperature: 125°C; Number of Pins: 4; Max Output Voltage: 3.3V; Min Operating Temperature: -40°C; Nominal Output Voltage: 3.3V; Package Quantity: 1; Min Output Voltage: 3.3V; Number of Outputs: 1
W1 W2 = Jumper: Jumper Wire; Published: 24-Mar-1999; LatestRevisionDate: 17-Jul-2002; LatestRevisionNote: Re-released for DXP Platform.; PackageReference: RAD-0.2; Publisher: Altium Limited; PackageDescription: Radial Cap, Thru-Hole; 2 Leads; 0.2 in Pin Spacing

## Nets that join several sheets
3V3: connector (P2.1 R25.2 R26.2), matrix (11 pins), uc (6 pins), supply (W2.2)
5V: connector (P2.3), supply (J1.1 J2.2 W1.1)
GND: connector (15 pins), matrix (30 pins), uc (9 pins), supply (7 pins)
COL0: connector (P5.1), matrix (U2.11 U3.1), uc (U70.3)
COL1: connector (P5.2), matrix (U2.10 U3.2), uc (U70.16)
COL2: connector (P5.3), matrix (U2.9 U3.3), uc (U70.17)
DOUT: connector (P1.1), uc (U70.14)
I2C1_SCL: connector (P4.1 R26.1), uc (U70.20)
I2C1_SDA: connector (P4.2 R25.1), uc (U70.2)
READ: connector (P6.1), matrix (U2.5), uc (U70.15)
ROW0: connector (P7.1), matrix (U1.1), uc (U70.11)
ROW1: connector (P7.2), matrix (U1.2), uc (U70.12)
ROW2: connector (P7.3), matrix (U1.3), uc (U70.13)
U2CTS: connector (P3.4 W3.2), uc (U70.7)
U2RTS: connector (P3.3 W4.2), uc (U70.8)
U2RX: connector (P3.1 U5.20), uc (W7.2)
U2TX: connector (P3.2 U5.4), uc (W6.2)